# EAGLE design absensi_wemos (EAGLE 9.2.0)
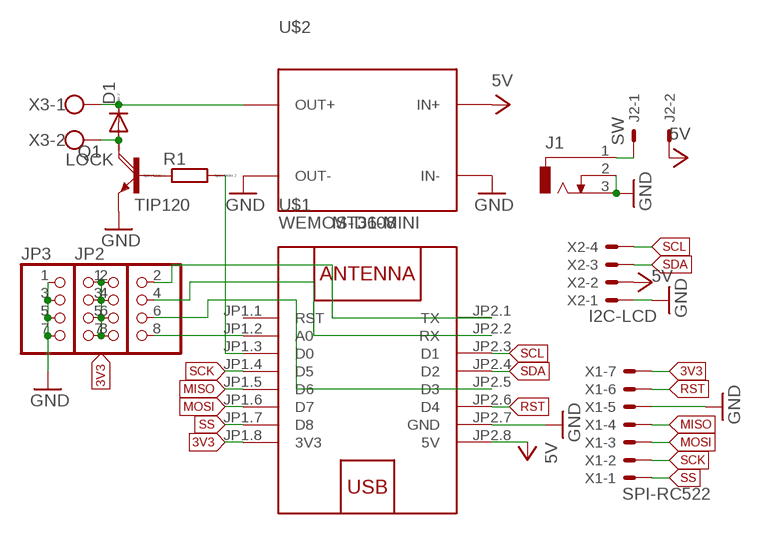
[diagram p0: schematic, sheet 1]

## Parts
D1  DIODE-DO-214AC  [DO-214AC]
J1  DCJ0303  [DCJ0303]
J2  SW  22-27-2021-02  [6410-02]
JP2  PINHD-2X4  [2X04]
JP3  PINHD-2X4  [2X04]
Q1  TIP120  [TO220AH]
R1  R0207/10  [0207/10]
U$1  WEMOS-D1-MINI  [WEMOS-D1-MINI]
U$2  MT3608  DC-DC-STEP-UP-MT3608  [DC-DC-STEP-UP-MT3608]
X1  SPI-RC522  22-27-2071-07  [6410-07]
X2  I2C-LCD  22-27-2041-04  [6410-04]
X3  LOCK  W237-102  [W237-102]

## Nets
3V3: JP2.1 JP2.3 JP2.5 JP2.7 JP3.2 JP3.4 JP3.6 JP3.8 U$1.JP1.8(3V3) X1.7
GND: J1.2 J1.3 JP3.1 JP3.3 JP3.5 JP3.7 Q1.E U$1.JP2.7(GND) U$2.IN- U$2.OUT- X1.5 X2.1
MISO: U$1.JP1.5(D6) X1.4
MOSI: U$1.JP1.6(D7) X1.3
N$1: J1.1 J2.1
N$2: R1.2 U$1.JP1.3(D0)
N$3: Q1.B R1.1
N$4: D1.C U$2.OUT+ X3.1
N$5: D1.A Q1.C X3.2
N$6: JP2.8 U$1.JP1.2(A0)
N$7: JP2.6 U$1.JP2.5(D3)
N$8: JP2.4 U$1.JP2.2(RX)
N$9: JP2.2 U$1.JP2.1(TX)
RST: U$1.JP2.6(D4) X1.6
SCK: U$1.JP1.4(D5) X1.2
SCL: U$1.JP2.3(D1) X2.4
SDA: U$1.JP2.4(D2) X2.3
SS: U$1.JP1.7(D8) X1.1
VCC: J2.2 U$1.JP2.8(5V) U$2.IN+ X2.2 ; supply symbol labelled 5V
Unconnected: U$1.JP1.1(RST)

## Library data of the parts
D1 = diode:DIODE-: DIODE
J1 = con-jack:DCJ0303: DC POWER JACK Source: DCJ0303.pdf; OC_FARNELL: unknown; OC_NEWARK: unknown
J2 = con-molex:22-?-02: CONNECTOR wire to board 2.54 mm (.1 inch) pitch header; MF: MOLEX; OC_FARNELL: unknown; OC_NEWARK: unknown
JP2 JP3 = pinhead:PINHD-2X4: PIN HEADER
Q1 = transistor-power:TIP120: NPN DARLINGTON TRANSISTOR
R1 = eagle-ltspice:R: RESISTOR, European symbol; SPICEMODEL: NONE; SPICEPREFIX: R
U$1 = diy-modules:WEMOS-D1-MINI: WEMOS D1 mini: Mini Wi-Fi Board based on ESP-8266 device More details can be found here: https://www.wemos.cc/product/d1-mini.html Click here to find device on ebay.com <http://www.ebay.com/sch/wemos+d1+mini+nodemcu>
U$2 = diy-modules:DC-DC-STEP-UP-MT3608: DC/DC Step-Up Regulator based on MT3608 chip MT3608 datasheet available here: https://www.olimex.com/Products/Breadboarding/BB-PWR-3608/resources/MT3608.pdf Click here to find device on ebay.com <http://www.ebay.com/sch/mt3608+module>
X1 = con-molex:22-?-07: CONNECTOR wire to board 2.54 mm (.1 inch) pitch header; MF: MOLEX; OC_FARNELL: unknown; OC_NEWARK: unknown
X2 = con-molex:22-?-04: CONNECTOR wire to board 2.54 mm (.1 inch) pitch header; MF: MOLEX; OC_FARNELL: unknown; OC_NEWARK: unknown
X3 = con-wago-500:W237-102: WAGO SCREW CLAMP; MPN: 237-102; OC_FARNELL: unknown; OC_NEWARK: 70K9898

## Board
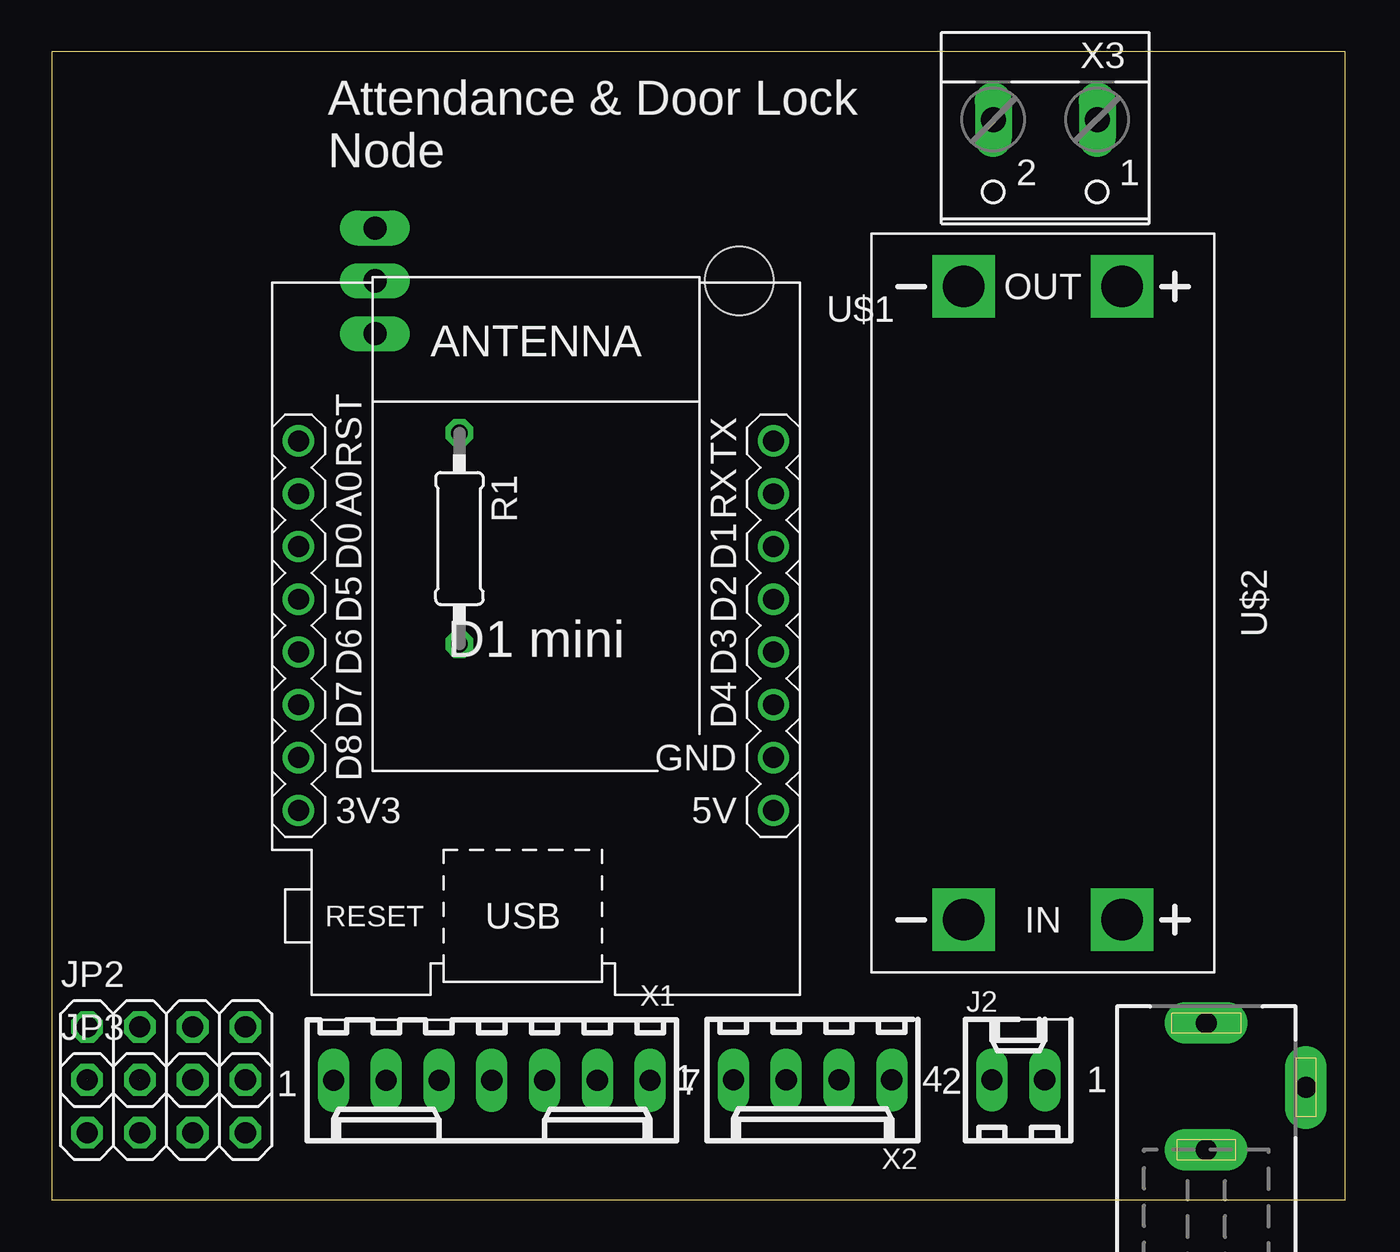
[diagram p1: board, top side]
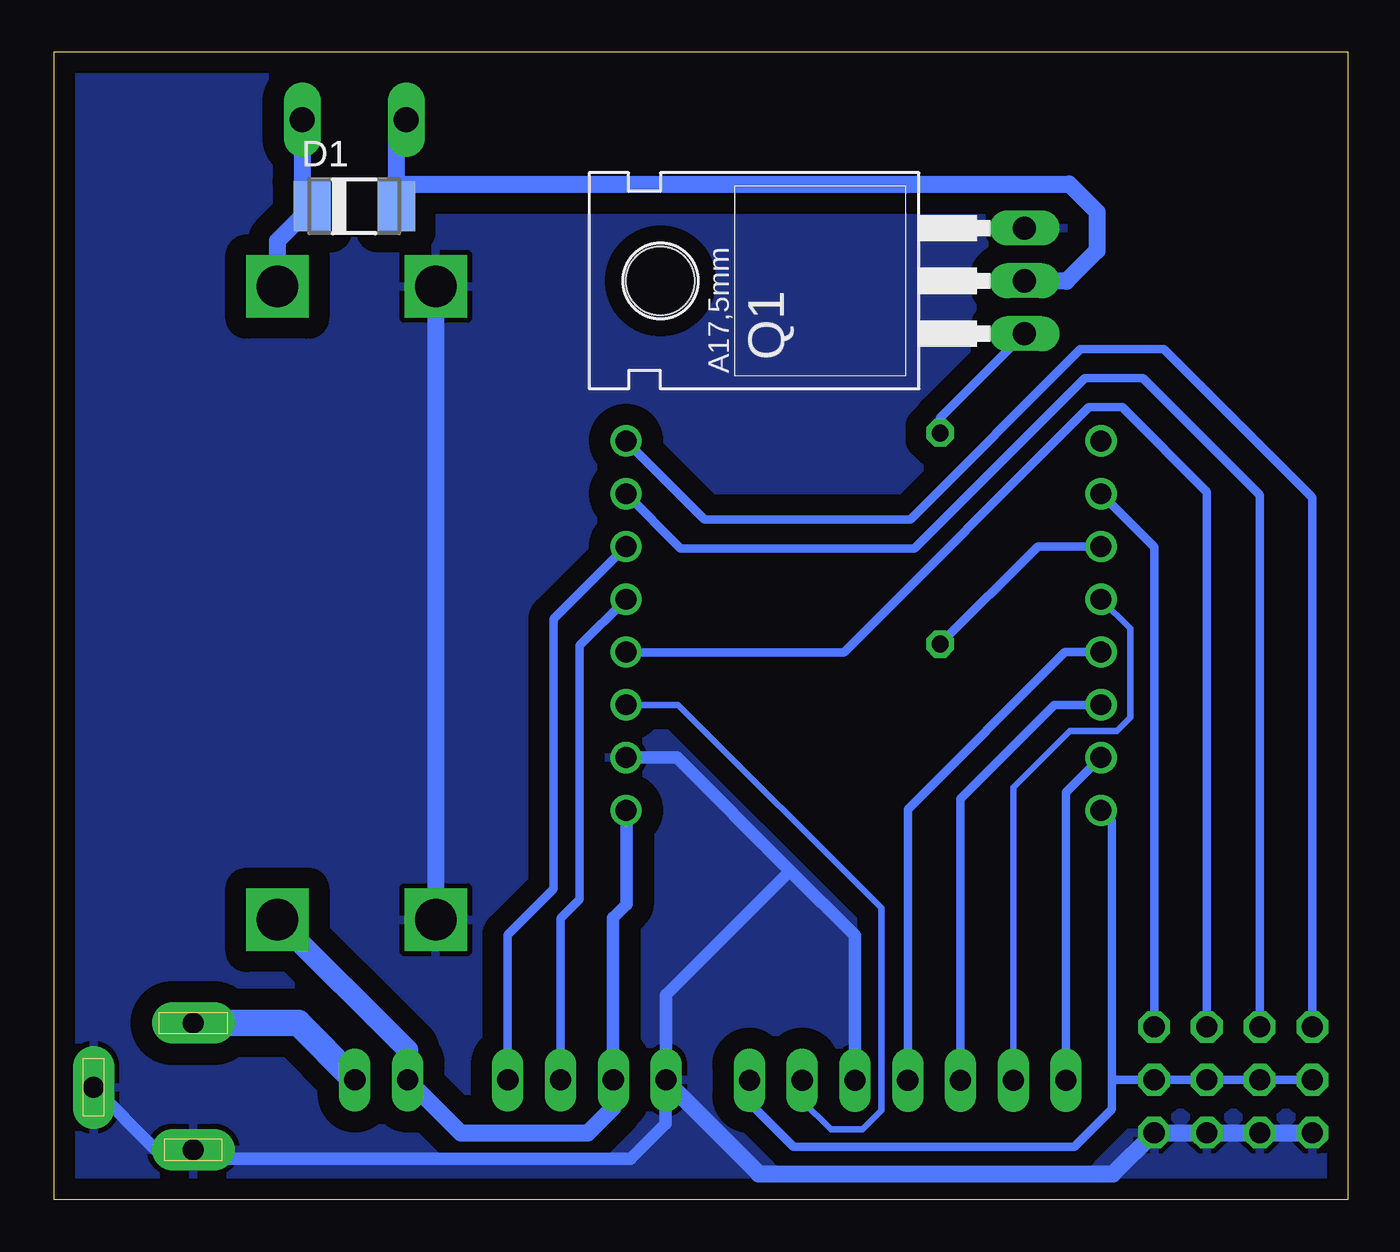
[diagram p2: board, bottom side, seen from below]

Size 62.25 x 55.25 mm. Coordinates in mm from the lower left corner, seen from the top.
Outline: 0,0 62.25,0 62.25,55.25 0,55.25 0,0
Copper layers (1*16): Top 0.035mm / dielectric 1.5mm / Bottom 0.035mm
Design rules "default": minimum track width 6mil, minimum drill 0.35mm, track to track 6mil, track to pad 6mil, pad to pad 6mil, via to via 6mil, smd to smd 6mil, copper to edge 40mil, drill to drill 6mil, minimum pad ring 10mil, minimum via ring 8mil, stop-mask expansion 4mil, vias tented up to drill 0mil, thermal gap 10mil

### Footprints (pad centres in the part's own frame; a part is rotated, then mirrored left to right if it is on the bottom)
DO-214AC = smd 1.8 x 2.4: A 2.025,0; C -2.025,0
DCJ0303 = drill 1 pad 2 long: 1 0,3.1; 2 4.8,0; 3 0,-3
6410-02 = drill 1.016 long: 1 1.27,0; 2 -1.27,0
2X04 = drill 1.016 octagon: 1 -3.81,-1.27; 2 -3.81,1.27; 3 -1.27,-1.27; 4 -1.27,1.27; 5 1.27,-1.27; 6 1.27,1.27; 7 3.81,-1.27; 8 3.81,1.27
TO220AH = drill 1.118 long: B -2.54,-6.35; C 0,-6.35; E 2.54,-6.35 | hole 3.302: 0,11.176
0207/10 = drill 0.813 octagon: 1 -5.08,0; 2 5.08,0
WEMOS-D1-MINI = drill 1: JP1.1 -11.43,9.525; JP1.2 -11.43,6.985; JP1.3 -11.43,4.445; JP1.4 -11.43,1.905; JP1.5 -11.43,-0.635; JP1.6 -11.43,-3.175; JP1.7 -11.43,-5.715; JP1.8 -11.43,-8.255; JP2.1 11.43,9.525; JP2.2 11.43,6.985; JP2.3 11.43,4.445; JP2.4 11.43,1.905; JP2.5 11.43,-0.635; JP2.6 11.43,-3.175; JP2.7 11.43,-5.715; JP2.8 11.43,-8.255
DC-DC-STEP-UP-MT3608 = drill 2 pad 2.8 square: IN+ 15.24,3.81; IN- 15.24,-3.81; OUT+ -15.24,3.81; OUT- -15.24,-3.81
6410-07 = drill 1.016 long: 1 7.62,0; 2 5.08,0; 3 2.54,0; 4 0,0; 5 -2.54,0; 6 -5.08,0; 7 -7.62,0
6410-04 = drill 1.016 long: 1 3.81,0; 2 1.27,0; 3 -1.27,0; 4 -3.81,0
W237-102 = drill 1.194 long: 1 -2.5,-1.27; 2 2.5,-1.27

### Placement (x,y rotation side)
D1  47.81,47.82 0 bottom
J1  55.56,5.41 0 top
J2  46.51,5.77 0 top
JP2  5.5,7.05 0 top
JP3  5.5,4.5 0 top
Q1  21.9,44.23 90 bottom
R1  19.61,31.83 270 top
U$1  23.3,27 0 top
U$2  47.7,28.72 270 top
X1  21.17,5.75 180 top
X2  36.61,5.77 180 top
X3  47.81,50.72 180 top

### Tracks (layer width: path | path; a pad name or v marks a point on that pad's centre or on a via)
3V3  (2 unrouted)
  Bottom 0.406: X1.7 28.79,4.67 26.67,2.55 13.15,2.55 11.35,4.35 11.35,5.78 | U$1.JP1.8 11.35,18.23 11.35,5.78 | JP3.4 JP3.2 | JP2.5 JP2.3 | JP2.5 JP3.6 | JP2.7 JP2.5 | JP2.7 JP3.8 | 11.35,5.78 JP2.7
GND
  Bottom 0.61: U$1.JP2.7 32.27,21.29 26.83,15.84 | J1.2 57.36,2.41 J1.3 55.12,1.97 34.52,1.97 32.83,3.66 32.83,5.74 X2.1 32.8,9.87 26.83,15.84 | X1.5 23.71,12.72 26.83,15.84
  Bottom 0.813: U$2.OUT- U$2.IN- | 32.83,5.74 28.34,1.25 11.29,1.25 JP3.7 JP3.5 JP3.3 JP3.1
  pour Bottom (isolate 1.016): 0.25,55 62,55 62,0 0.25,0
MISO
  Bottom 0.406: U$1.JP1.5 13.6,26.36 21.17,18.79 X1.4
MOSI
  Bottom 0.406: U$1.JP1.6 14.11,23.82 18.63,19.3 X1.3
N$1
  Bottom 1.27: J1.1 50.52,8.51 J2.1
N$2
  Bottom 0.406: U$1.JP1.3 14.91,31.45 R1.2
N$3
  Bottom 0.406: R1.1 19.61,37.63 Q1.B
N$4
  Bottom 0.813: X3.1 50.31,48.3 D1.C 51.51,46.15 U$2.OUT+
N$5
  Bottom 0.813: X3.2 45.78,51.52 45.78,48.86 | 45.78,48.86 D1.A | Q1.C 13.55,44.23 13.53,44.21 12.06,45.68 12.06,47.55 13.4,48.89 45.76,48.89 45.78,48.86
N$6
  Bottom 0.406: JP2.8 9.31,31.43 U$1.JP1.2
N$7
  Bottom 0.406: JP2.6 6.77,34.07 10.85,38.15 12.45,38.15 24.25,26.35 34.72,26.35 U$1.JP2.5
N$8
  Bottom 0.406: JP2.4 4.23,33.93 9.85,39.55 12.65,39.55 20.85,31.35 32.09,31.35 U$1.JP2.2
N$9
  Bottom 0.406: JP2.2 1.69,33.79 8.85,40.95 12.85,40.95 21.05,32.75 30.95,32.75 U$1.JP2.1
RST
  Bottom 0.305: U$1.JP2.6 32.22,23.82 22.44,14.05 22.44,4.31 23.36,3.39 24.87,3.39 26.25,4.77 X1.6
SCK
  Bottom 0.305: U$1.JP1.4 10.46,27.5 10.46,23.22 11.11,22.57 13.36,22.57 16.09,19.84 X1.2
SCL
  Bottom 0.406: U$1.JP2.3 38.21,27.96 38.21,14.97 40.42,12.76 X2.4
SDA
  Bottom 0.406: U$1.JP2.4 36.96,26.68 36.96,14.47 37.88,13.55 X2.3
SS
  Bottom 0.406: U$1.JP1.7 13.55,19.61 X1.1
VCC
  Bottom 0.61: U$1.JP2.8 34.71,18.73 34.71,14.22 35.36,13.57 35.36,5.75
  Bottom 0.813: J2.2 42.69,3.22 36.56,3.22 35.36,4.42 35.36,5.75 X2.2
  Bottom 1.016: U$2.IN+ 45.24,7.21 J2.2

### Text on the board
tPlace: Attendance & Door Lock / Node
tValues: TX | RX | D3 | A0